# Altium project PCB_Project.PrjPcb
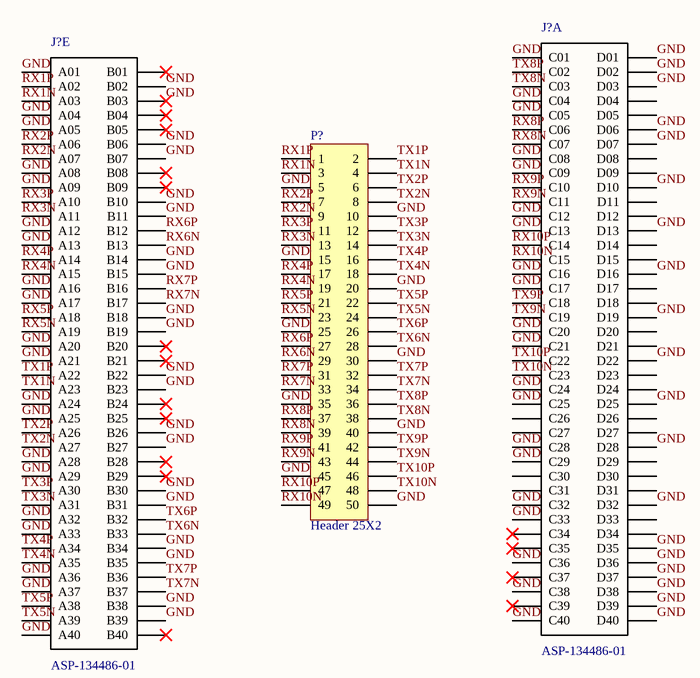
[diagram p0: UART_schem.SchDoc]
3 sheets, 17 parts. Net scope: global (net labels, ports and power ports of the same name join across sheets).
Sheets:
  UART_schem.SchDoc
  GPIO_schem.SchDoc
  Sheet1.SchDoc

## Sheet UART_schem.SchDoc
size A

### Parts
(Parts that share a designator on the sheet are numbered #1, #2 ... from top to bottom, then left to right.)
J?#1  ASP-134486-01  [*SAMTEC_ASP-134486-01_ASP-134486-01(Primary)]  (part A of 5)
J?#2  ASP-134486-01  [*SAMTEC_ASP-134486-01_ASP-134486-01(Primary)]  (part E of 5)
P?#1  Header 25X2  [HDR2X25]

### Nets
GND: J?#1.C1(C01) J?#1.C4(C04) J?#1.C5(C05) J?#1.C8(C08) J?#1.C9(C09) J?#1.C12 J?#1.C13 J?#1.C16 J?#1.C17 J?#1.C20 J?#1.C21 J?#1.C24 J?#1.C25 J?#1.C28 J?#1.C29 J?#1.C32 J?#1.C33 J?#1.C36 J?#1.C38 J?#1.C40 J?#1.D1(D01) J?#1.D2(D02) J?#1.D3(D03) J?#1.D6(D06) J?#1.D7(D07) J?#1.D10 J?#1.D13 J?#1.D16 J?#1.D19 J?#1.D22 J?#1.D25 J?#1.D28 J?#1.D32 J?#1.D35 J?#1.D36 J?#1.D37 J?#1.D38 J?#1.D39 J?#1.D40 J?#2.A1(A01) J?#2.A4(A04) J?#2.A5(A05) J?#2.A8(A08) J?#2.A9(A09) J?#2.A12 J?#2.A13 J?#2.A16 J?#2.A17 J?#2.A20 J?#2.A21 J?#2.A24 J?#2.A25 J?#2.A28 J?#2.A29 J?#2.A32 J?#2.A33 J?#2.A36 J?#2.A37 J?#2.A40 J?#2.B2(B02) J?#2.B3(B03) J?#2.B6(B06) J?#2.B7(B07) J?#2.B10 J?#2.B11 J?#2.B14 J?#2.B15 J?#2.B18 J?#2.B19 J?#2.B22 J?#2.B23 J?#2.B26 J?#2.B27 J?#2.B30 J?#2.B31 J?#2.B34 J?#2.B35 J?#2.B38 J?#2.B39 P?#1.5 P?#1.10 P?#1.15 P?#1.20 P?#1.25 P?#1.30 P?#1.35 P?#1.40 P?#1.45 P?#1.50
RX1N: J?#2.A3(A03) P?#1.3
RX1P: J?#2.A2(A02) P?#1.1
RX2N: J?#2.A7(A07) P?#1.9
RX2P: J?#2.A6(A06) P?#1.7
RX3N: J?#2.A11 P?#1.13
RX3P: J?#2.A10 P?#1.11
RX4N: J?#2.A15 P?#1.19
RX4P: J?#2.A14 P?#1.17
RX5N: J?#2.A19 P?#1.23
RX5P: J?#2.A18 P?#1.21
RX6N: J?#2.B13 P?#1.29
RX6P: J?#2.B12 P?#1.27
RX7N: J?#2.B17 P?#1.33
RX7P: J?#2.B16 P?#1.31
RX8N: J?#1.C7(C07) P?#1.39
RX8P: J?#1.C6(C06) P?#1.37
RX9N: J?#1.C11 P?#1.43
RX9P: J?#1.C10 P?#1.41
RX10N: J?#1.C15 P?#1.49
RX10P: J?#1.C14 P?#1.47
TX1N: J?#2.A23 P?#1.4
TX1P: J?#2.A22 P?#1.2
TX2N: J?#2.A27 P?#1.8
TX2P: J?#2.A26 P?#1.6
TX3N: J?#2.A31 P?#1.14
TX3P: J?#2.A30 P?#1.12
TX4N: J?#2.A35 P?#1.18
TX4P: J?#2.A34 P?#1.16
TX5N: J?#2.A39 P?#1.24
TX5P: J?#2.A38 P?#1.22
TX6N: J?#2.B33 P?#1.28
TX6P: J?#2.B32 P?#1.26
TX7N: J?#2.B37 P?#1.34
TX7P: J?#2.B36 P?#1.32
TX8N: J?#1.C3(C03) P?#1.38
TX8P: J?#1.C2(C02) P?#1.36
TX9N: J?#1.C19 P?#1.44
TX9P: J?#1.C18 P?#1.42
TX10N: J?#1.C23 P?#1.48
TX10P: J?#1.C22 P?#1.46

Not connected (* = marked no-connect by the designer): J?#1 C26 C27 C30 C31 C34* C35* C37* C39* D4(D04) D5(D05) D8(D08) D9(D09) D11 D12 D14 D15 D17 D18 D20 D21 D23 D24 D26 D27 D29 D30 D31 D33 D34; J?#2 B1(B01)* B4(B04)* B5(B05)* B8(B08)* B9(B09)* B20* B21* B24* B25* B28* B29* B40*

### Library data of the parts
J?#1 J?#2 = ASP-134486-01: 400 Position Connector Array, Female Sockets Surface Mount Gold; MF: Samtec Inc.; MP: ASP-134486-01; Digi-Key_Purchase_URL: https://www.digikey.com/product-detail/en/samtec-inc/ASP-134486-01/SAM8728CT-ND/2135095?utm_source=snapeda&utm_medium=aggregator&utm_campaign=symbol; SnapEDA_Link: https://www.snapeda.com/parts/ASP-134486-01/Samtec%20Inc./view-part/898249/?ref=snap; Package: None; Digi-Key_Part_Number: SAM8728CT-ND; Value: *
P?#1 = Header 25X2: Header, 25-Pin, Dual row; LatestRevisionDate: 17-Jul-2002; LatestRevisionNote: Re-released for DXP Platform.; Publisher: Altium Limited

## Sheet GPIO_schem.SchDoc
size A
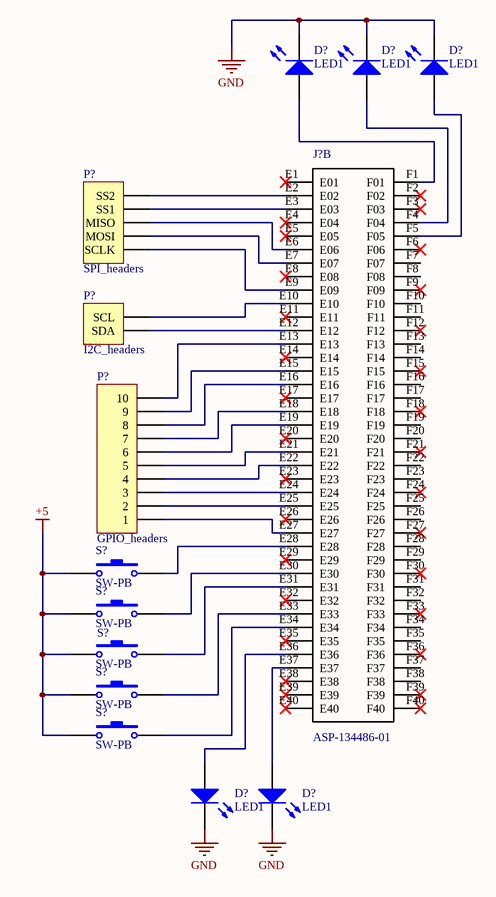
[diagram p1: GPIO_schem.SchDoc]

### Parts
(Parts that share a designator on the sheet are numbered #1, #2 ... from top to bottom, then left to right.)
D?#1  LED1  [LED-1]
D?#2  LED1  [LED-1]
D?#3  LED1  [LED-1]
D?#4  LED1  [LED-1]
D?#5  LED1  [LED-1]
J?#3  ASP-134486-01  [*SAMTEC_ASP-134486-01_ASP-134486-01(Primary)]  (part B of 5)
P?#2  SPI_headers  [HDR1X5]
P?#3  I2C_headers  [HDR1X2]
P?#4  GPIO_headers  [HDR1X10]
S?#1  SW-PB  [SPST-2]
S?#2  SW-PB  [SPST-2]
S?#3  SW-PB  [SPST-2]
S?#4  SW-PB  [SPST-2]
S?#5  SW-PB  [SPST-2]

### Nets
+5: S?#1.1 S?#2.1 S?#3.1 S?#4.1 S?#5.1
GND: D?#1.2(K) D?#2.2(K) D?#3.2(K) D?#4.2(K) D?#5.2(K)
NetD?#1_1: D?#1.1(A) J?#3.F1(F01)
NetD?#2_1: D?#2.1(A) J?#3.F4(F04)
NetD?#3_1: D?#3.1(A) J?#3.F5(F05)
NetD?#4_1: D?#4.1(A) J?#3.E36
NetD?#5_1: D?#5.1(A) J?#3.E37
NetJ?#3_E2: J?#3.E2(E02) P?#2.5(SS2)
NetJ?#3_E3: J?#3.E3(E03) P?#2.4(SS1)
NetJ?#3_E6: J?#3.E6(E06) P?#2.3(MISO)
NetJ?#3_E7: J?#3.E7(E07) P?#2.2(MOSI)
NetJ?#3_E9: J?#3.E9(E09) P?#2.1(SCLK)
NetJ?#3_E10: J?#3.E10 P?#3.2(SCL)
NetJ?#3_E12: J?#3.E12 P?#3.1(SDA)
NetJ?#3_E13: J?#3.E13 P?#4.10
NetJ?#3_E15: J?#3.E15 P?#4.9
NetJ?#3_E16: J?#3.E16 P?#4.8
NetJ?#3_E18: J?#3.E18 P?#4.7
NetJ?#3_E19: J?#3.E19 P?#4.6
NetJ?#3_E21: J?#3.E21 P?#4.5
NetJ?#3_E22: J?#3.E22 P?#4.4
NetJ?#3_E24: J?#3.E24 P?#4.3
NetJ?#3_E25: J?#3.E25 P?#4.2
NetJ?#3_E27: J?#3.E27 P?#4.1
NetJ?#3_E28: J?#3.E28 S?#1.2
NetJ?#3_E30: J?#3.E30 S?#2.2
NetJ?#3_E31: J?#3.E31 S?#3.2
NetJ?#3_E33: J?#3.E33 S?#4.2
NetJ?#3_E34: J?#3.E34 S?#5.2

Not connected (* = marked no-connect by the designer): J?#3 E1(E01)* E4(E04)* E5(E05)* E8(E08)* E11* E14* E17* E20* E23* E26* E29* E32* E35* E38* E39* E40* F2(F02)* F3(F03)* F6(F06)* F7(F07) F8(F08) F9(F09)* F10 F11 F12* F13 F14 F15* F16 F17 F18* F19 F20 F21* F22 F23 F24* F25 F26 F27* F28 F29 F30* F31 F32 F33* F34 F35 F36* F37 F38 F39* F40*

### Library data of the parts
D?#1-D?#5 = LED1: Typical RED GaAs LED; Published: 8-Jun-2000; LatestRevisionDate: 08-Jul-2005; LatestRevisionNote: Mech Layer 1 removed.; PackageReference: LED-1; Publisher: Altium Limited; PackageDescription: LED; 2 Leads
J?#3 = ASP-134486-01: as J?#1 on sheet UART_schem; MP: ASP-134486-01; Digi-Key_Purchase_URL: https://www.digikey.com/product-detail/en/samtec-inc/ASP-134486-01/SAM8728CT-ND/2135095?utm_source=snapeda&utm_medium=aggregator&utm_campaign=symbol; SnapEDA_Link: https://www.snapeda.com/parts/ASP-134486-01/Samtec%20Inc./view-part/898249/?ref=snap; Package: None; Digi-Key_Part_Number: SAM8728CT-ND; Value: *
P?#2 = Header 5: Header, 5-Pin; LatestRevisionDate: 17-Jul-2002; LatestRevisionNote: Re-released for DXP Platform.; Publisher: Altium Limited
P?#3 = Header 2: Header, 2-Pin; LatestRevisionDate: 17-Jul-2002; LatestRevisionNote: Re-released for DXP Platform.; Publisher: Altium Limited
P?#4 = Header 10: Header, 10-Pin; LatestRevisionDate: 17-Jul-2002; LatestRevisionNote: Re-released for DXP Platform.; Publisher: Altium Limited
S?#1-S?#5 = SW-PB: Switch; Published: 24-Mar-1999; LatestRevisionDate: 17-Jul-2002; LatestRevisionNote: Re-released for DXP Platform.; PackageReference: SPST-2; Publisher: Altium Limited; PackageDescription: Switch; 2 Leads

## Sheet Sheet1.SchDoc
size A
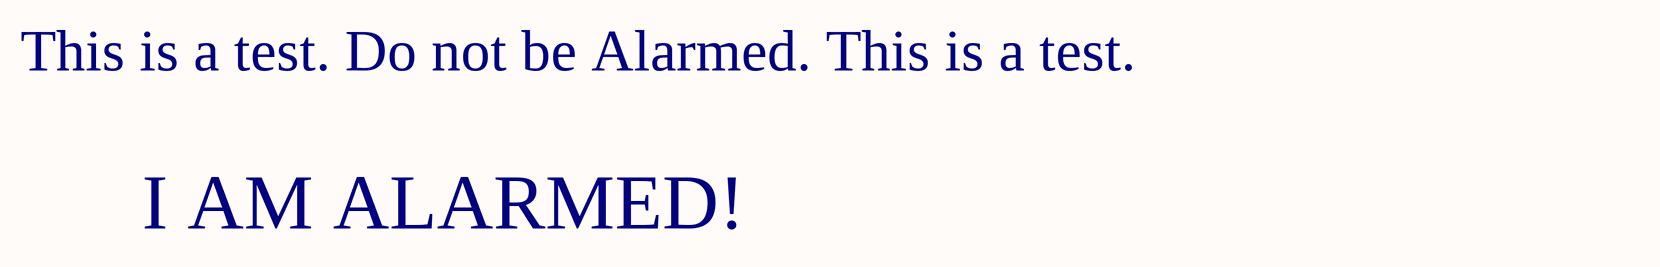
[diagram p2: Sheet1.SchDoc]

### Notes on the sheet
- This is a test. Do not be Alarmed. This is a test.
- I AM ALARMED!

## Nets that join several sheets
GND: UART_schem (89 pins), GPIO_schem (5 pins)